# Altium schematic sheet Comms.SchDoc
size A
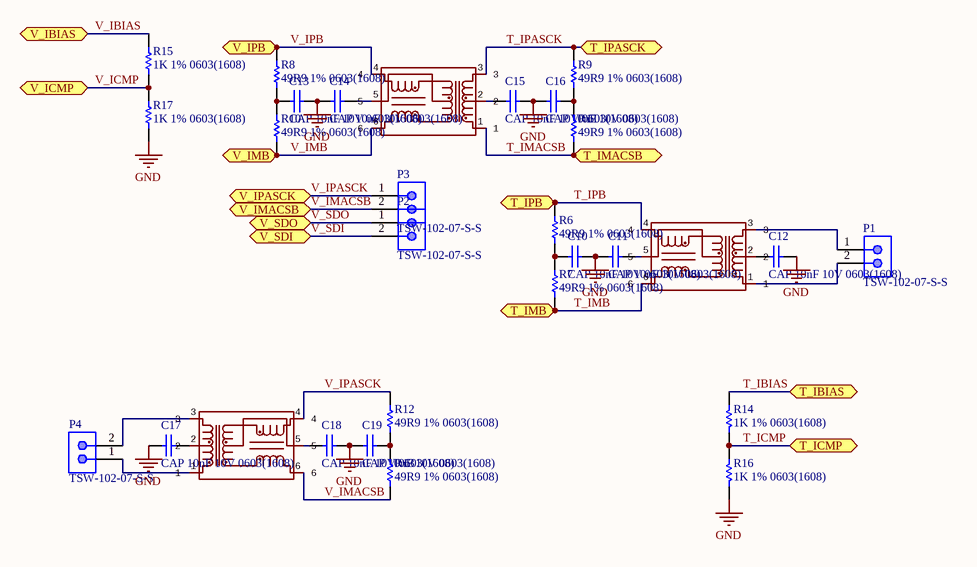
[diagram p0: Comms.SchDoc]

## Parts
4  HM2108NL  [HM2108NL]  (value not drawn)
5  HM2108NL  [HM2108NL]  (value not drawn)
6  HM2108NL  [HM2108NL]  (value not drawn)
C10  CAP 10nF 10V 0603(1608)  [CAPC0603(1608)100_M]
C11  CAP 10nF 10V 0603(1608)  [CAPC0603(1608)100_M]
C12  CAP 10nF 10V 0603(1608)  [CAPC0603(1608)100_M]
C13  CAP 10nF 10V 0603(1608)  [CAPC0603(1608)100_M]
C14  CAP 10nF 10V 0603(1608)  [CAPC0603(1608)100_M]
C15  CAP 10nF 10V 0603(1608)  [CAPC0603(1608)100_M]
C16  CAP 10nF 10V 0603(1608)  [CAPC0603(1608)100_M]
C17  CAP 10nF 10V 0603(1608)  [CAPC0603(1608)100_M]
C18  CAP 10nF 10V 0603(1608)  [CAPC0603(1608)100_M]
C19  CAP 10nF 10V 0603(1608)  [CAPC0603(1608)100_M]
P1  TSW-102-07-S-S  [SMTC-TSW-102-07-S-S]
P2  TSW-102-07-S-S  [SMTC-TSW-102-07-S-S]
P3  TSW-102-07-S-S  [SMTC-TSW-102-07-S-S]
P4  TSW-102-07-S-S  [SMTC-TSW-102-07-S-S]
R6  49R9 1% 0603(1608)  [RESC0603(1608)_N]
R7  49R9 1% 0603(1608)  [RESC0603(1608)_N]
R8  49R9 1% 0603(1608)  [RESC0603(1608)_N]
R9  49R9 1% 0603(1608)  [RESC0603(1608)_N]
R10  49R9 1% 0603(1608)  [RESC0603(1608)_N]
R11  49R9 1% 0603(1608)  [RESC0603(1608)_N]
R12  49R9 1% 0603(1608)  [RESC0603(1608)_N]
R13  49R9 1% 0603(1608)  [RESC0603(1608)_N]
R14  1K 1% 0603(1608)  [RESC0603(1608)_M]
R15  1K 1% 0603(1608)  [RESC0603(1608)_M]
R16  1K 1% 0603(1608)  [RESC0603(1608)_M]
R17  1K 1% 0603(1608)  [RESC0603(1608)_M]

## Ports
T_IBIAS (bidir), T_ICMP (bidir), T_IMACSB (bidir), T_IMB (bidir), T_IPASCK (bidir), T_IPB (bidir), V_IBIAS (bidir), V_ICMP (bidir), V_IMACSB (bidir), V_IMB (bidir), V_IPASCK (bidir), V_IPB (bidir), V_SDI (bidir), V_SDO (bidir)

## Nets
GND: C10.2 C11.1 C12.2 C13.2 C14.1 C15.2 C16.1 C17.1 C18.2 C19.1 R16.1 R17.1
T_IBIAS: R14.2 ; port T_IBIAS
T_ICMP: R14.1 R16.2 ; port T_ICMP
T_IMACSB: 5.1 R11.1 ; port T_IMACSB
T_IMB: 4.6 R7.1 ; port T_IMB
T_IPASCK: 5.3 R9.2 ; port T_IPASCK
T_IPB: 4.4 R6.2 ; port T_IPB
V_IBIAS: R15.2 ; port V_IBIAS
V_ICMP: R15.1 R17.2 ; port V_ICMP
V_IMACSB: 6.6 P3.2 R13.1 ; port V_IMACSB
V_IMB: 5.6 R10.1 ; port V_IMB
V_IPASCK: 6.4 P3.1 R12.2 ; port V_IPASCK
V_IPB: 5.4 R8.2 ; port V_IPB
V_SDI: P2.2 ; port V_SDI
V_SDO: P2.1 ; port V_SDO
Net4_1: 4.1 P1.2
Net4_2: 4.2 C12.1
Net4_3: 4.3 P1.1
Net4_5: 4.5 C11.2
Net5_2: 5.2 C15.1
Net5_5: 5.5 C14.2
Net6_1: 6.1 P4.1
Net6_2: 6.2 C17.2
Net6_3: 6.3 P4.2
Net6_5: 6.5 C18.1
NetC10_1: C10.1 R6.1 R7.2
NetC13_1: C13.1 R8.1 R10.2
NetC16_2: C16.2 R9.1 R11.2
NetC19_2: C19.2 R12.1 R13.2

## Library data of the parts
4-6 = HM2108NL: GateName_1: G$1; SymbolName_1: HM2108NL; LibraryName: Transformers and Chokes; DeviceSetName: HM2108NL; Package: HM2108NL
C10-C19 = CMP-1035-02304-1: CAP 10nF 10V ±2% 0603 (1608 Metric) Thickness 1mm SMD; Tolerance: Â±2%; Case-EIA: 0603; Case-Metric: 1608; Technology: SMT; Rated Voltage: 10 V; Value: 10nF; Max Thickness: 1 mm
P1 P3 = CMP-1681-00004-3: Male Header, Pitch 2.54 mm, 1 x 2 Position, Height 8.38 mm, Tail Length 2.54 mm, -55 to 125 degC, RoHS, Bulk; Rows: 1; Contact Plating: Gold; Length: 5.08 mm; PackageReference: TSW-102-07-S-S; Package Quantity: 1; Packaging: Bulk; Pins: 2; Max Operating Temperature: 125 degC; Mounting Technology: Through Hole; Mount: Through Hole; Min Operating Temperature: -55 degC; Height: 8.38 mm; PackageDescription: Male Header, Pitch 2.54 mm, 1 x 2 Position, Height 8.38 mm, Tail Length 2.54 mm; RoHSCompliant: true; Contact Material: Bronze; REACH SVHC: No SVHC; Lead Pitch: 0.1 inch; DatasheetVersion: 12/2015; Colour: Black; Contact Finish: Gold
P2 P4 = CMP-1681-00004-4: Male Header, Pitch 2.54 mm, 1 x 2 Position, Height 8.38 mm, Tail Length 2.54 mm, -55 to 125 degC, RoHS, Bulk; Manufacturer: Samtec; Rows: 1; ComponentLink1URL: http://www.samtec.com/; Contact Finish: Gold; Mounting Technology: Through Hole; PackageReference: TSW-102-07-S-S; RoHSCompliant: true; Pins: 2; Contact Material: Bronze; ComponentLink2Description: Datasheet; Max Operating Temperature: 125 degC; Min Operating Temperature: -55 degC; Height: 8.38 mm; Packaging: Bulk; ComponentLink1Description: Manufacturer URL; PackageDescription: Male Header, Pitch 2.54 mm, 1 x 2 Position, Height 8.38 mm, Tail Length 2.54 mm; Colour: Black; Contact Plating: Gold; Length: 5.08 mm; ComponentLink2URL: http://suddendocs.samtec.com/catalog_english/tsw_th.pdf; DatasheetVersion: 12/2015; Mount: Through Hole; Lead Pitch: 0.1 inch; REACH SVHC: No SVHC; Package Quantity: 1
R6-R13 = CMP-1012-00363-1: 49R9 0.1W 1% 0603 (1608 Metric)  SMD; Case-Metric: 1608; Case-EIA: 0603; Value: 49.90 Ohm; Power: 0.1 W; Tolerance: 1 %; Technology: SMT
R14-R17 = CMP-1012-00510-1: 1K 0.1W 1% 0603 (1608 Metric)  SMD; Case-Metric: 1608; Case-EIA: 0603; Value: 1000.00 Ohm; Technology: SMT; Tolerance: 1 %; Power: 0.1 W